# Altium schematic sheet Motor Interface.SchDoc
size A4; Author: Azmat Bilal; Organization: Shamrock Green; Revision: 1.0.0; SheetNumber: 3; SheetTotal: 4
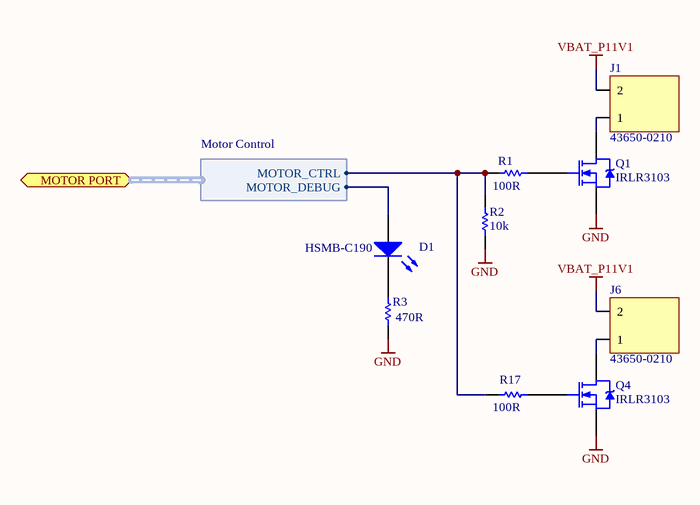
[diagram p0: Motor Interface.SchDoc]

## Parts
D1  HSMB-C190  [1.6X0.8X0.8]
J1  43650-0210  [43650-0210]
J6  43650-0210  [43650-0210]
Q1  IRLR3103  [TO-252AA_N]
Q4  IRLR3103  [TO-252AA_N]
R1  value 100R  [3-0603]  (hidden comment: ERJ3GEYJ101V)
R2  value 10k  [3-0603]  (hidden comment: ERJ3GEYJ103V)
R3  value 470R  [3-0603]  (hidden comment: ERJ3GEYJ471V)
R17  value 100R  [3-0603]  (hidden comment: ERJ3GEYJ101V)

## Ports
MOTOR PORT (harness Motor Control)

## Harnesses
Motor Control: MOTOR_CTRL, MOTOR_DEBUG

## Nets
GND: Q1.3(S) Q4.3(S) R2.2 R3.1
VBAT_P11V1: J1.2 J6.2
NetD1_1: D1.1(A) ; port MOTOR PORT.MOTOR_DEBUG
NetD1_2: D1.2(K) R3.2
NetJ1_1: J1.1 Q1.4(D)
NetJ6_1: J6.1 Q4.4(D)
NetQ1_1: Q1.1(G) R1.2
NetQ4_1: Q4.1(G) R17.2
NetR1_1: R1.1 R2.1 R17.1 ; port MOTOR PORT.MOTOR_CTRL

## Notes on the sheet
- Project:
- Auther:
- Sheet
- of
- Shamrock Green
- Date:
- Revision:
- Time:

## Library data of the parts
D1 = HSMB-C190: Blue Surface Mount Chip LED, Blue; LuminousIntensity: 1.6mcd (Minimum).; PCB_Layout: Complies with manufacturer's recommendation.; Published: 11-Dec-2002; DatasheetVersion: 26-Feb-2002; PackageVersion: Mar-2002; PackageReference: 1.6X0.8X0.8; Publisher: Altium Limited; PackageDescription: SM LED; 2 Flat Leads; LED_Colour: Blue; ComponentLink1Description: Manufacturer Link; ComponentLink1URL: http://www.avagotech.com/; ComponentLink2Description: Datasheet; ComponentLink2URL: http://cp.literature.agilent.com/litweb/pdf/5988-5211EN.pdf
J1 J6 = 43650-0210: Power Connector, Micro-Fit 3.0 Header, SMT, Single Row, Right Angle, 2 Circuits; datasheet: http://www.molex.com/pdm_docs/sd/436500210_sd.pdf; Product Series literature: http://rhu103.sma-promail.com/SQLImages/kelmscott/Molex/PDF_Images/987650-5984.pdf
Q1 Q4 = IRLR3103: HEXFET Power MOSFET; Note: Pin 2 is trimmed and is electrically connected to Drain.; Published: 8-Jun-2000; LatestRevisionDate: 20-Nov-2009; LatestRevisionNote: IPC-7351 Footprint Added.; DatasheetVersion: Nov-1998; PackageVersion: Feb-2003; PackageReference: TO-252AA; Publisher: Altium Limited; PackageDescription: 3-Pin HEXFET Package 2.28 mm Pitch, 9.9 mm Lead Span; Code_JEDEC: TO-252-AA; ComponentLink1Description: Manufacturer Link; ComponentLink1URL: http://www.irf.com/; ComponentLink2Description: Datasheet; ComponentLink2URL: http://www.irf.com/product-info/datasheets/data/irlr3103.pdf
R1-R3 R17 = ERJ3GE: Thick Film Chip Resistor, 1 Ohm to 10M Ohm Range, 5% Tolerance, 0603 Size, 0.1 W; Note: If flow soldering, adjust pad width of PCB Footprint to 0.7 - 0.8 times the width of the resistor.; Published: 17-Dec-2003; LatestRevisionDate: 19-Mar-2004; LatestRevisionNote: Silkscreen size reduced.; PackageDocument: Mar-2003; PackageReference: 3-0603; Publisher: Altium Limited; Code_IPC: 1608 [0603]; ComponentLink1Description: Manufacturer Link; ComponentLink1URL: http://www.panasonic.com/industrial/components/resistive_products.htm; ComponentLink2Description: Datasheet; ComponentLink2URL: http://www.panasonic.com/industrial/components/pdf/AOA0000CE1.pdf